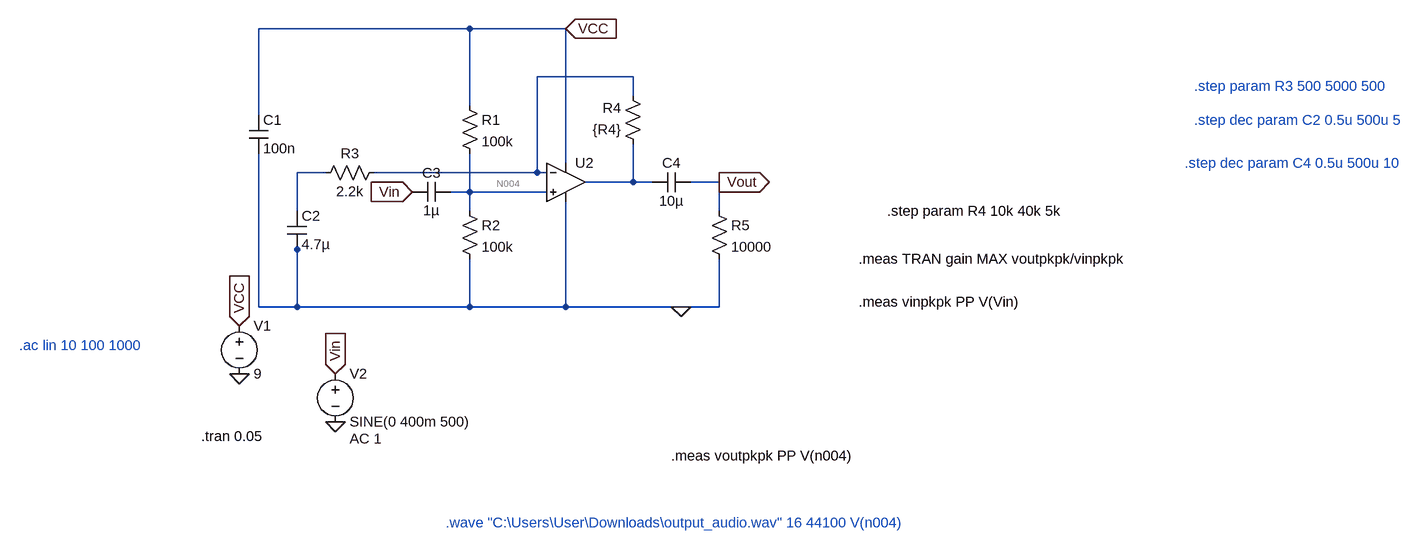
[diagram p0: schematic preamp1.asc]
preamp1.asc, the LTspice schematic file:
Version 4.1
SHEET 1 2600 744
WIRE 256 -96 -96 -96
WIRE 416 -96 256 -96
WIRE 528 -16 368 -16
WIRE 528 16 528 -16
WIRE 256 32 256 -96
WIRE -96 48 -96 -96
WIRE 416 128 416 -96
WIRE 16 144 -32 144
WIRE 368 144 368 -16
WIRE 368 144 96 144
WIRE 384 144 368 144
WIRE 528 160 528 96
WIRE 528 160 448 160
WIRE 560 160 528 160
WIRE 672 160 624 160
WIRE 256 176 256 112
WIRE 256 176 224 176
WIRE 384 176 256 176
WIRE -32 208 -32 144
WIRE 256 208 256 176
WIRE 672 208 672 160
WIRE -32 272 -32 256
WIRE -96 368 -96 112
WIRE -32 368 -32 272
WIRE -32 368 -96 368
WIRE 256 368 256 288
WIRE 256 368 -32 368
WIRE 416 368 416 192
WIRE 416 368 256 368
WIRE 608 368 416 368
WIRE 672 368 672 288
WIRE 672 368 608 368
FLAG -128 480 0
FLAG -128 400 VCC
IOPIN -128 400 In
FLAG 416 -96 VCC
IOPIN 416 -96 In
FLAG 32 560 0
FLAG 32 480 Vin
IOPIN 32 480 In
FLAG 160 176 Vin
IOPIN 160 176 In
FLAG 608 368 0
FLAG 672 160 Vout
IOPIN 672 160 Out
SYMBOL voltage -128 384 R0
WINDOW 123 0 0 Left 0
WINDOW 39 0 0 Left 0
SYMATTR InstName V1
SYMATTR Value 9
SYMBOL res 240 16 R0
SYMATTR InstName R1
SYMATTR Value 100k
SYMBOL res 240 192 R0
SYMATTR InstName R2
SYMATTR Value 100k
SYMBOL cap -112 48 R0
SYMATTR InstName C1
SYMATTR Value 100n
SYMBOL res 112 128 R90
WINDOW 0 0 56 VBottom 2
WINDOW 3 32 56 VTop 2
SYMATTR InstName R3
SYMATTR Value 2.2k
SYMBOL cap -48 208 R0
SYMATTR InstName C2
SYMATTR Value 4.7µ
SYMBOL cap 224 160 R90
WINDOW 0 0 32 VBottom 2
WINDOW 3 32 32 VTop 2
SYMATTR InstName C3
SYMATTR Value 1µ
SYMBOL cap 624 144 R90
WINDOW 0 0 32 VBottom 2
WINDOW 3 32 32 VTop 2
SYMATTR InstName C4
SYMATTR Value 10µ
SYMBOL res 544 112 R180
WINDOW 0 36 76 Left 2
WINDOW 3 36 40 Left 2
SYMATTR InstName R4
SYMATTR Value {R4}
SYMBOL voltage 32 464 R0
WINDOW 123 24 124 Left 2
WINDOW 39 0 0 Left 0
SYMATTR Value2 AC 1
SYMATTR InstName V2
SYMATTR Value SINE(0 400m 500)
SYMBOL res 656 192 R0
SYMATTR InstName R5
SYMATTR Value 10000
SYMBOL OpAmps\\UniversalOpAmp 416 160 R0
SYMATTR InstName U2
SYMATTR Value2 Avol=1Meg GBW=3Meg Vos=3
SYMATTR SpiceLine En=18 Enk=0 In=0 Ink=0 Rin=500Meg
TEXT -192 584 Left 2 !.tran 0.05
TEXT 592 616 Left 2 !.meas voutpkpk PP V(n004)
TEXT 216 728 Left 2 ;.wave "C:\\Users\\User\\Downloads\\output_audio.wav" 16 44100 V(n004)
TEXT 952 208 Left 2 !.step param R4 10k 40k 5k
TEXT -840 432 Left 2 ;.ac lin 10 100 1000
TEXT 904 288 Left 2 !.meas TRAN gain MAX voutpkpk/vinpkpk
TEXT 904 360 Left 2 !.meas vinpkpk PP V(Vin)
TEXT 2200 0 Left 2 ;.step param R3 500 5000 500
TEXT 2200 56 Left 2 ;.step dec param C2 0.5u 500u 5
TEXT 2184 128 Left 2 ;.step dec param C4 0.5u 500u 10

The netlist it stands for:
* preamp1.asc
V1 VCC 0 9
R1 VCC N004 100k
R2 N004 0 100k
C1 VCC 0 100n
R3 N001 N002 2.2k
C2 N002 0 4.7µ
C3 N004 Vin 1µ
C4 Vout N003 10µ
R4 N003 N001 {R4}
V2 Vin 0 SINE(0 400m 500) AC 1
R5 Vout 0 10000
X§U2 N004 N001 VCC 0 N003 level1 Avol=1Meg GBW=3Meg Vos=3 En=18 Enk=0 In=0 Ink=0 Rin=500Meg  ; pins In+ In- V+ V- OUT
.tran 0.05
.meas voutpkpk PP V(n004)
* .wave "C:\Users\User\Downloads\output_audio.wav" 16 44100 V(n004)
.step param R4 10k 40k 5k
* .ac lin 10 100 1000
.meas TRAN gain MAX voutpkpk/vinpkpk
.meas vinpkpk PP V(Vin)
* .step param R3 500 5000 500
* .step dec param C2 0.5u 500u 5
* .step dec param C4 0.5u 500u 10
.lib UniversalOpAmp1.lib
.backanno
.end